# Altium schematic sheet Comparator.SchDoc
size A4; SheetNumber: 8; SheetTotal: 10; SPICEModelCacheRNZNTXQS: <root> / <DocumentId>RNZNTXQS</DocumentId> / <CacheFrame Number="0"> / <Model Name="1n4001" Kind="MDL"> / <Text>*1N4001 MCE 8-16-95 / *50V 1A Si GenPurpose Diode pkg:DIODE0.4 1,2 / .MODEL 1N4001 D(IS=2.55E-9 RS=0.042 N=1.75 TT=5.76E-6 CJO=1.85E-11 / + VJ=0.75 M=0.333 BV=50 IBV=1E-5 )</Text> / </Model> / </CacheFrame> / </root>
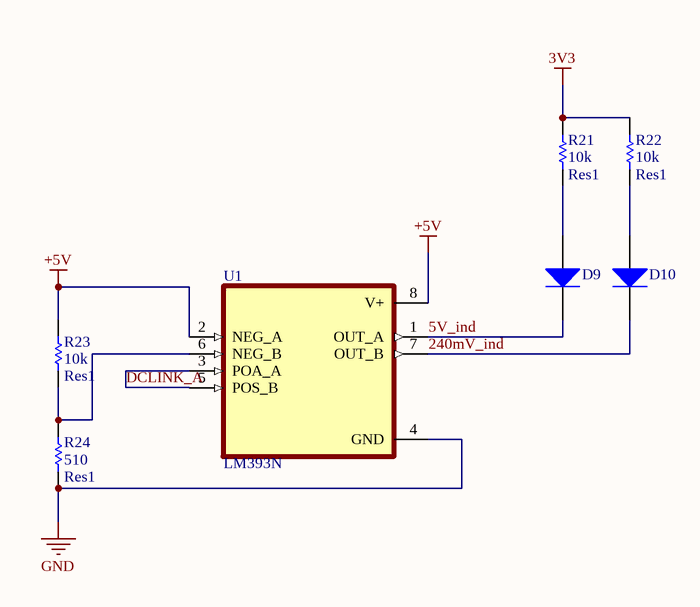
[diagram p0: Comparator.SchDoc]

## Parts
D9  Diode 1N4001  [DO-41]  (value not drawn)
D10  Diode 1N4001  [DO-41]  (value not drawn)
R21  Res1  value 10k  [AXIAL-0.4]
R22  Res1  value 10k  [AXIAL-0.4]
R23  Res1  value 10k  [AXIAL-0.4]
R24  Res1  value 510  [AXIAL-0.4]
U1  LM393N  [DIP794W45P254L959H508Q8]

## Nets
3V3: R21.2 R22.2
+5V: R23.2 U1.2(NEG_A) U1.8(V+)
GND: R24.1 U1.4(GND)
5V_ind: D9.2(K) U1.1(OUT_A)
240mV_ind: D10.2(K) U1.7(OUT_B)
DCLINK_A: U1.3(POA_A) U1.5(POS_B)
NetD9_1: D9.1(A) R21.1
NetD10_1: D10.1(A) R22.1
NetR23_1: R23.1 R24.2 U1.6(NEG_B)

## Library data of the parts
D9 D10 = Diode 1N4001: 1 Amp General Purpose Rectifier; Published: 8-Jun-2000; LatestRevisionDate: 17-Jul-2002; LatestRevisionNote: Re-released for DXP Platform.; DatasheetVersion: 1998; PackageVersion: Aug-1999; PackageReference: DO-41; Publisher: Altium Limited; PackageDescription: Diode, Axial; Body 5.2 x 2.7 mm (LxDia. max), Lead Dia. 0.86 mm (max); Code_JEDEC: DO-204-AL; ComponentLink1Description: Manufacturer Link; ComponentLink1URL: http://www.fairchildsemi.com/; ComponentLink2Description: Datasheet; ComponentLink2URL: http://www.fairchildsemi.com/ds/1N%2F1N4001.pdf
R21-R24 = Res1: Resistor; Published: 8-Jun-2000; LatestRevisionDate: 17-Jul-2002; LatestRevisionNote: Re-released for DXP Platform.; PackageReference: AXIAL-0.3; Publisher: Altium Limited; PackageDescription: Axial Device, Thru-Hole; 2 Leads; 0.3 in Pin Spacing
U1 = LM393N: Low Power Low Offset Voltage Dual Comparator 8-PDIP 0 to 70; MF: Texas Instruments; MP: LM393N/NOPB; Digi-Key_Part_Number: LM393NNS/NOPB-ND; Mouser-Purchase-URL: https://snapeda.com/shop?store=Mouser&id=67776; SnapEDA_Link: https://www.snapeda.com/parts/LM393N/NOPB/Texas%20Instruments/view-part/67776/?ref=snap; Texas_Instruments-Purchase-URL: https://snapeda.com/shop?store=Texas+Instruments&id=67776; Value: *; Package: PDIP-8 Texas Instruments; DigiKey-Purchase-URL: https://snapeda.com/shop?store=DigiKey&id=67776; BuyPart: https://www.snapeda.com/parts/LM393N/NOPB/Texas%20Instruments/view-part/67776/?ref=eda